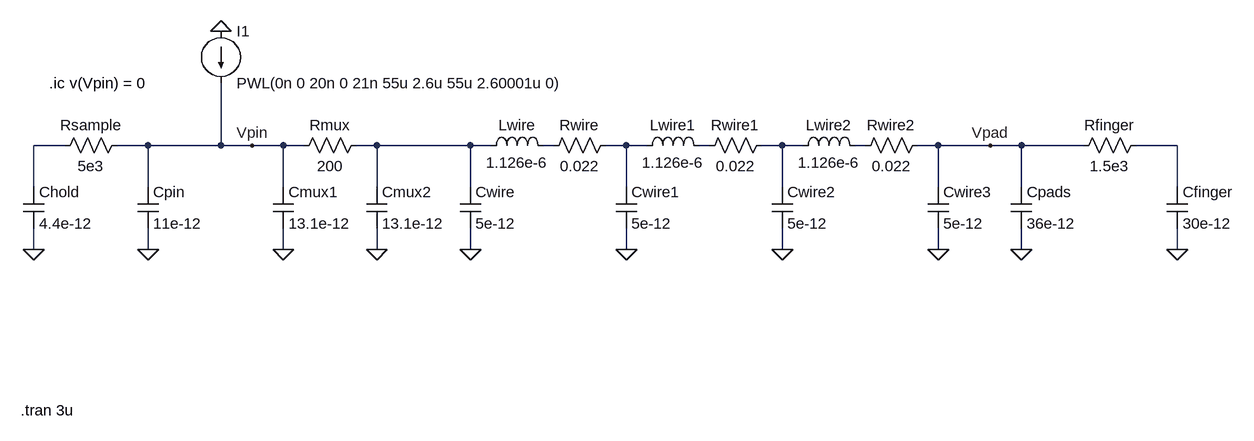
[diagram p0: schematic Draft1.asc]
Draft1.asc, the LTspice schematic file:
Version 4
SHEET 1 1916 680
WIRE 96 64 48 64
WIRE 224 64 176 64
WIRE 336 64 336 -32
WIRE 336 64 224 64
WIRE 384 64 336 64
WIRE 432 64 384 64
WIRE 464 64 432 64
WIRE 576 64 544 64
WIRE 720 64 576 64
WIRE 752 64 720 64
WIRE 848 64 832 64
WIRE 960 64 928 64
WIRE 992 64 960 64
WIRE 1088 64 1072 64
WIRE 1200 64 1168 64
WIRE 1232 64 1200 64
WIRE 1328 64 1312 64
WIRE 1440 64 1408 64
WIRE 1520 64 1440 64
WIRE 1568 64 1520 64
WIRE 1664 64 1568 64
WIRE 1808 64 1744 64
WIRE 48 128 48 64
WIRE 224 128 224 64
WIRE 432 128 432 64
WIRE 576 128 576 64
WIRE 720 128 720 64
WIRE 960 128 960 64
WIRE 1200 128 1200 64
WIRE 1440 128 1440 64
WIRE 1568 128 1568 64
WIRE 1808 128 1808 64
WIRE 48 224 48 192
WIRE 224 224 224 192
WIRE 432 224 432 192
WIRE 576 224 576 192
WIRE 720 224 720 192
WIRE 960 224 960 192
WIRE 1200 224 1200 192
WIRE 1440 224 1440 192
WIRE 1568 224 1568 192
WIRE 1808 224 1808 192
FLAG 48 224 0
FLAG 224 224 0
FLAG 432 224 0
FLAG 576 224 0
FLAG 720 224 0
FLAG 960 224 0
FLAG 1200 224 0
FLAG 1440 224 0
FLAG 1568 224 0
FLAG 1808 224 0
FLAG 336 -112 0
FLAG 384 64 Vpin
FLAG 1520 64 Vpad
SYMBOL cap 32 128 R0
SYMATTR InstName Chold
SYMATTR Value 4.4e-12
SYMBOL cap 208 128 R0
SYMATTR InstName Cpin
SYMATTR Value 11e-12
SYMBOL res 192 48 R90
WINDOW 0 0 56 VBottom 2
WINDOW 3 32 56 VTop 2
SYMATTR InstName Rsample
SYMATTR Value 5e3
SYMBOL cap 416 128 R0
SYMATTR InstName Cmux1
SYMATTR Value 13.1e-12
SYMBOL cap 560 128 R0
SYMATTR InstName Cmux2
SYMATTR Value 13.1e-12
SYMBOL res 560 48 R90
WINDOW 0 0 56 VBottom 2
WINDOW 3 32 56 VTop 2
SYMATTR InstName Rmux
SYMATTR Value 200
SYMBOL ind 736 80 R270
WINDOW 0 32 56 VTop 2
WINDOW 3 5 56 VBottom 2
SYMATTR InstName Lwire
SYMATTR Value 1.126e-6
SYMBOL res 944 48 R90
WINDOW 0 0 56 VBottom 2
WINDOW 3 32 56 VTop 2
SYMATTR InstName Rwire
SYMATTR Value 0.022
SYMBOL cap 704 128 R0
SYMATTR InstName Cwire
SYMATTR Value 5e-12
SYMBOL ind 976 80 R270
WINDOW 0 32 56 VTop 2
WINDOW 3 5 56 VBottom 2
SYMATTR InstName Lwire1
SYMATTR Value 1.126e-6
SYMBOL res 1184 48 R90
WINDOW 0 0 56 VBottom 2
WINDOW 3 32 56 VTop 2
SYMATTR InstName Rwire1
SYMATTR Value 0.022
SYMBOL cap 944 128 R0
SYMATTR InstName Cwire1
SYMATTR Value 5e-12
SYMBOL ind 1216 80 R270
WINDOW 0 32 56 VTop 2
WINDOW 3 5 56 VBottom 2
SYMATTR InstName Lwire2
SYMATTR Value 1.126e-6
SYMBOL res 1424 48 R90
WINDOW 0 0 56 VBottom 2
WINDOW 3 32 56 VTop 2
SYMATTR InstName Rwire2
SYMATTR Value 0.022
SYMBOL cap 1184 128 R0
SYMATTR InstName Cwire2
SYMATTR Value 5e-12
SYMBOL cap 1424 128 R0
SYMATTR InstName Cwire3
SYMATTR Value 5e-12
SYMBOL cap 1552 128 R0
SYMATTR InstName Cpads
SYMATTR Value 36e-12
SYMBOL res 1760 48 R90
WINDOW 0 0 56 VBottom 2
WINDOW 3 32 56 VTop 2
SYMATTR InstName Rfinger
SYMATTR Value 1.5e3
SYMBOL cap 1792 128 R0
SYMATTR InstName Cfinger
SYMATTR Value 30e-12
SYMBOL current 336 -112 R0
WINDOW 123 0 0 Left 2
WINDOW 39 0 0 Left 2
SYMATTR InstName I1
SYMATTR Value PWL(0n 0 20n 0 21n 55u 2.6u 55u 2.60001u 0)
TEXT 28 472 Left 2 !.tran 3u
TEXT 72 -32 Left 2 !.ic v(Vpin) = 0

The netlist it stands for:
* Draft1.asc
Chold N001 0 4.4e-12
Cpin Vpin 0 11e-12
Rsample Vpin N001 5e3
Cmux1 Vpin 0 13.1e-12
Cmux2 N002 0 13.1e-12
Rmux N002 Vpin 200
Lwire N002 N003 1.126e-6
Rwire N004 N003 0.022
Cwire N002 0 5e-12
Lwire1 N004 N005 1.126e-6
Rwire1 N006 N005 0.022
Cwire1 N004 0 5e-12
Lwire2 N006 N007 1.126e-6
Rwire2 Vpad N007 0.022
Cwire2 N006 0 5e-12
Cwire3 Vpad 0 5e-12
Cpads Vpad 0 36e-12
Rfinger N008 Vpad 1.5e3
Cfinger N008 0 30e-12
I1 0 Vpin PWL(0n 0 20n 0 21n 55u 2.6u 55u 2.60001u 0)
.tran 3u
.ic v(Vpin) = 0
.backanno
.end